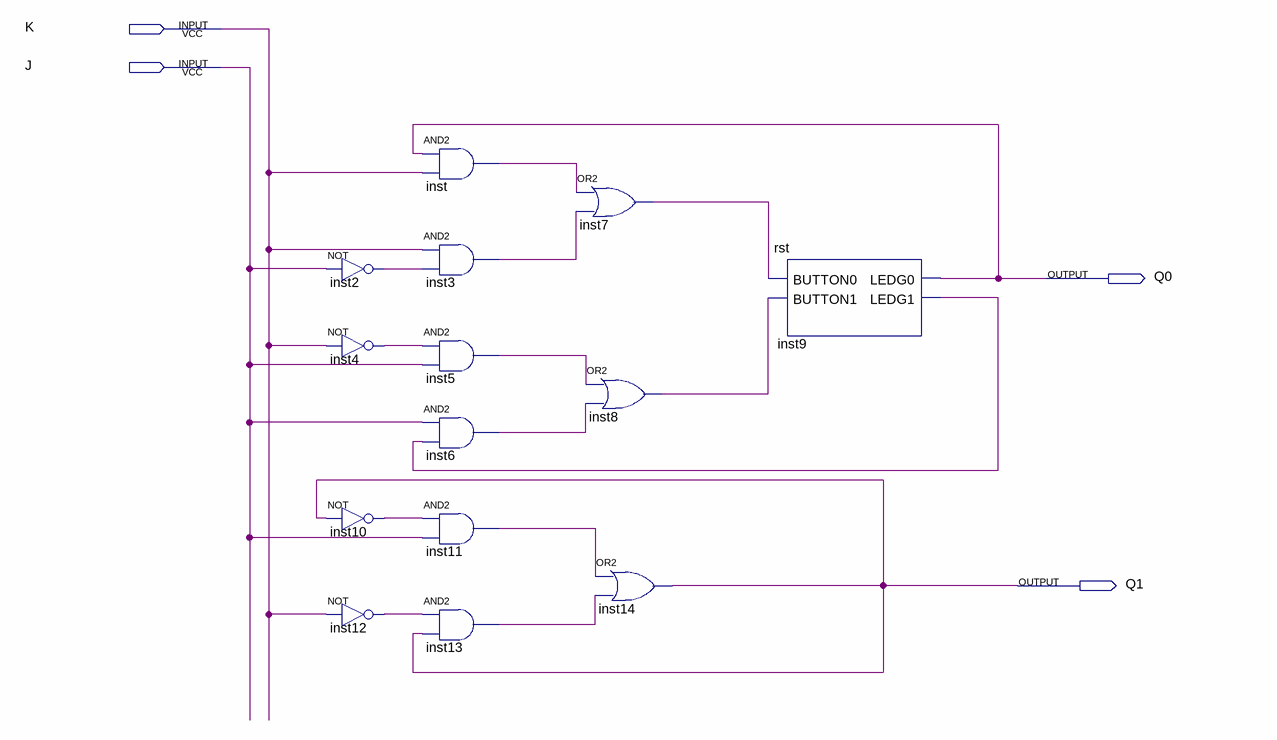
[diagram p0: schematic sheet]
// Quartus schematic Lab7.bdf as structural Verilog: 14 symbols, 4 pins
module Lab7 (
  input  K,
  input  J,
  output Q0,
  output Q1
);

  wire inst2_out, inst3_out, inst4_out, inst5_out, inst6_out, inst7_out, inst8_out, inst9_ledg1, inst10_out,
       inst11_out, inst12_out, inst13_out, inst_out;

  not inst2 (inst2_out, J);
  not inst4 (inst4_out, K);
  not inst10 (inst10_out, Q1);
  not inst12 (inst12_out, K);
  and inst (inst_out, Q0, K);
  and inst3 (inst3_out, K, inst2_out);
  and inst5 (inst5_out, inst4_out, J);
  and inst6 (inst6_out, J, inst9_ledg1);
  and inst11 (inst11_out, inst10_out, J);
  and inst13 (inst13_out, inst12_out, Q1);
  or inst7 (inst7_out, inst_out, inst3_out);
  or inst8 (inst8_out, inst5_out, inst6_out);
  or inst14 (Q1, inst11_out, inst13_out);
  rst inst9 (.BUTTON0(inst7_out), .BUTTON1(inst8_out), .LEDG0(Q0), .LEDG1(inst9_ledg1));
endmodule
